# Altium schematic sheet top.SchDoc
size A4; SheetNumber: 1; SheetTotal: 4
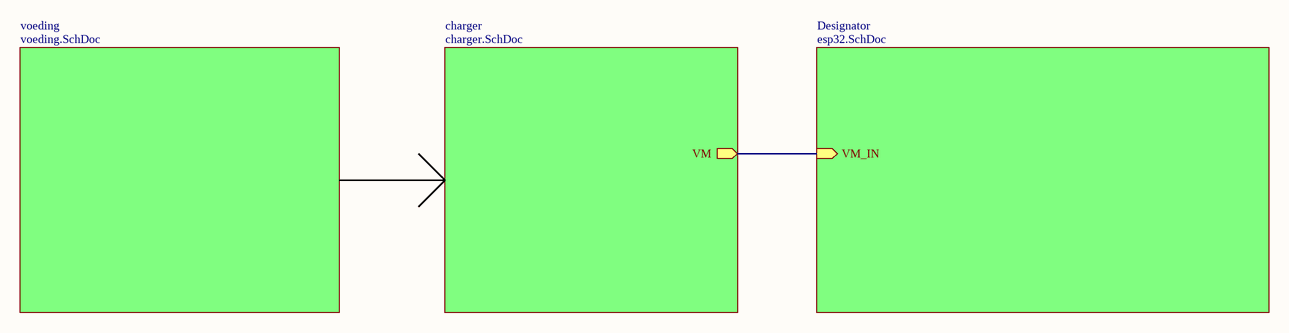
[diagram p0: top.SchDoc]

## Sub-sheets
charger = charger.SchDoc: VM (out)
Designator = esp32.SchDoc: VM_IN (in)
voeding = voeding.SchDoc: no entries

## Nets
(unnamed): sheet Designator/VM_IN, sheet charger/VM